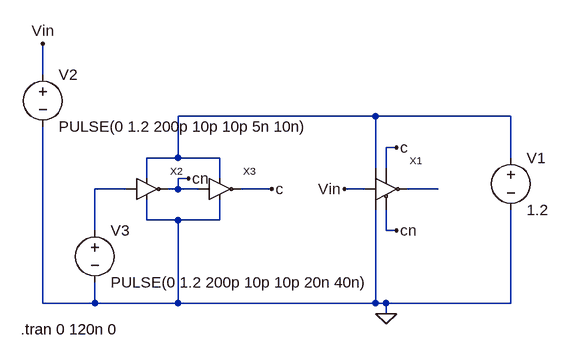
[diagram p0: schematic test_tristate_inv.asc]
test_tristate_inv.asc, the LTspice schematic file:
Version 4
SHEET 1 880 680
WIRE -336 -48 -336 -96
WIRE 176 16 -128 16
WIRE 384 16 176 16
WIRE 208 64 192 64
WIRE -128 80 -128 16
WIRE -128 80 -176 80
WIRE -64 80 -128 80
WIRE 384 80 384 16
WIRE 176 96 176 16
WIRE 192 96 192 64
WIRE -176 112 -176 80
WIRE -112 112 -128 112
WIRE -64 112 -64 80
WIRE -208 128 -256 128
WIRE -128 128 -128 112
WIRE -128 128 -144 128
WIRE -96 128 -128 128
WIRE 16 128 -32 128
WIRE 160 128 128 128
WIRE 272 128 224 128
WIRE -176 176 -176 144
WIRE -128 176 -176 176
WIRE -64 176 -64 144
WIRE -64 176 -128 176
WIRE -256 192 -256 128
WIRE 192 192 192 160
WIRE 208 192 192 192
WIRE -336 304 -336 32
WIRE -256 304 -256 272
WIRE -256 304 -336 304
WIRE -128 304 -128 176
WIRE -128 304 -256 304
WIRE 176 304 176 160
WIRE 176 304 -128 304
WIRE 192 304 176 304
WIRE 384 304 384 160
WIRE 384 304 192 304
WIRE 192 320 192 304
FLAG 192 320 0
FLAG -336 -96 Vin
FLAG 128 128 Vin
FLAG -112 112 cn
FLAG 16 128 c
FLAG 208 192 cn
FLAG 208 64 c
SYMBOL Tristate_Inv 256 160 R0
SYMATTR InstName X1
SYMBOL voltage 384 64 R0
WINDOW 123 0 0 Left 0
WINDOW 39 0 0 Left 0
SYMATTR InstName V1
SYMATTR Value 1.2
SYMBOL voltage -336 -64 R0
WINDOW 123 0 0 Left 0
WINDOW 39 0 0 Left 0
SYMATTR InstName V2
SYMATTR Value PULSE(0 1.2 200p 10p 10p 5n 10n)
SYMBOL voltage -256 176 R0
WINDOW 123 0 0 Left 0
WINDOW 39 0 0 Left 0
SYMATTR InstName V3
SYMATTR Value PULSE(0 1.2 200p 10p 10p 20n 40n)
SYMBOL Inverter -144 144 R0
SYMATTR InstName X2
SYMBOL Inverter -32 144 R0
SYMATTR InstName X3
TEXT -370 344 Left 2 !.tran 0 120n 0

The netlist it stands for:
* test_tristate_inv.asc
XX1 Vin N001 0 c cn N003 Tristate_Inv  ; pins In VDD GND EN NEN Out
V1 N001 0 1.2
V2 Vin 0 PULSE(0 1.2 200p 10p 10p 5n 10n)
V3 N002 0 PULSE(0 1.2 200p 10p 10p 20n 40n)
XX2 N002 N001 0 cn Inverter  ; pins In VDD GND Out
XX3 cn N001 0 c Inverter  ; pins In VDD GND Out
.tran 0 120n 0
.backanno
.end